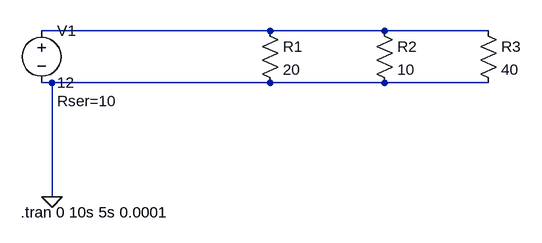
[diagram p0: schematic Draft3a.asc]
Draft3a.asc, the LTspice schematic file:
Version 4.1
SHEET 1 884 680
WIRE 0 128 -352 128
WIRE 176 128 0 128
WIRE 336 128 176 128
WIRE -336 208 -352 208
WIRE 0 208 -336 208
WIRE 176 208 0 208
WIRE 336 208 176 208
WIRE -336 384 -336 208
FLAG -336 384 0
SYMBOL voltage -352 112 R0
WINDOW 123 0 0 Left 0
WINDOW 39 24 124 Left 2
SYMATTR InstName V1
SYMATTR Value 12
SYMATTR SpiceLine Rser=10
SYMBOL res -16 112 R0
SYMATTR InstName R1
SYMATTR Value 20
SYMATTR SpiceLine tol=5 pwr=10
SYMBOL res 160 112 R0
SYMATTR InstName R2
SYMATTR Value 10
SYMBOL res 320 112 R0
SYMATTR InstName R3
SYMATTR Value 40
TEXT -384 408 Left 2 !.tran 0 10s 5s 0.0001

The netlist it stands for:
* Draft3a.asc
V1 N001 0 12 Rser=10
R1 N001 0 20 tol=5 pwr=10
R2 N001 0 10
R3 N001 0 40
.tran 0 10s 5s 0.0001
.backanno
.end